# EAGLE design host_0 (EAGLE 9.3.1)
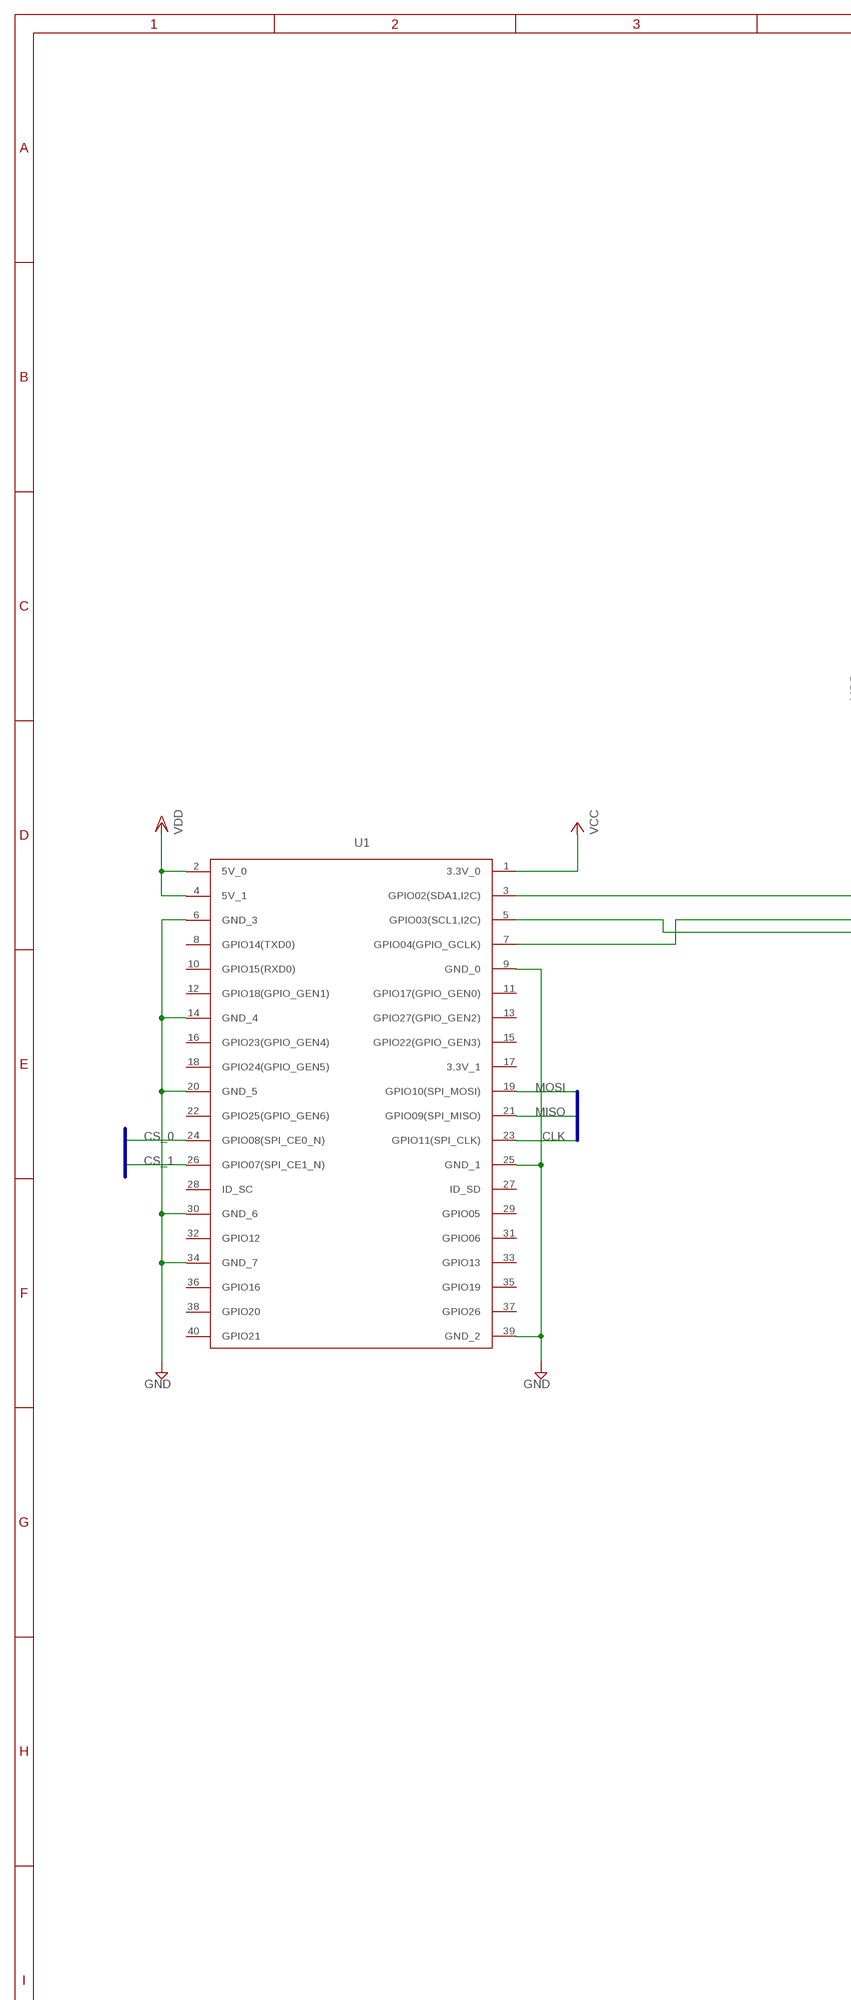
[diagram p0: schematic, sheet 1, part 1 of 2]
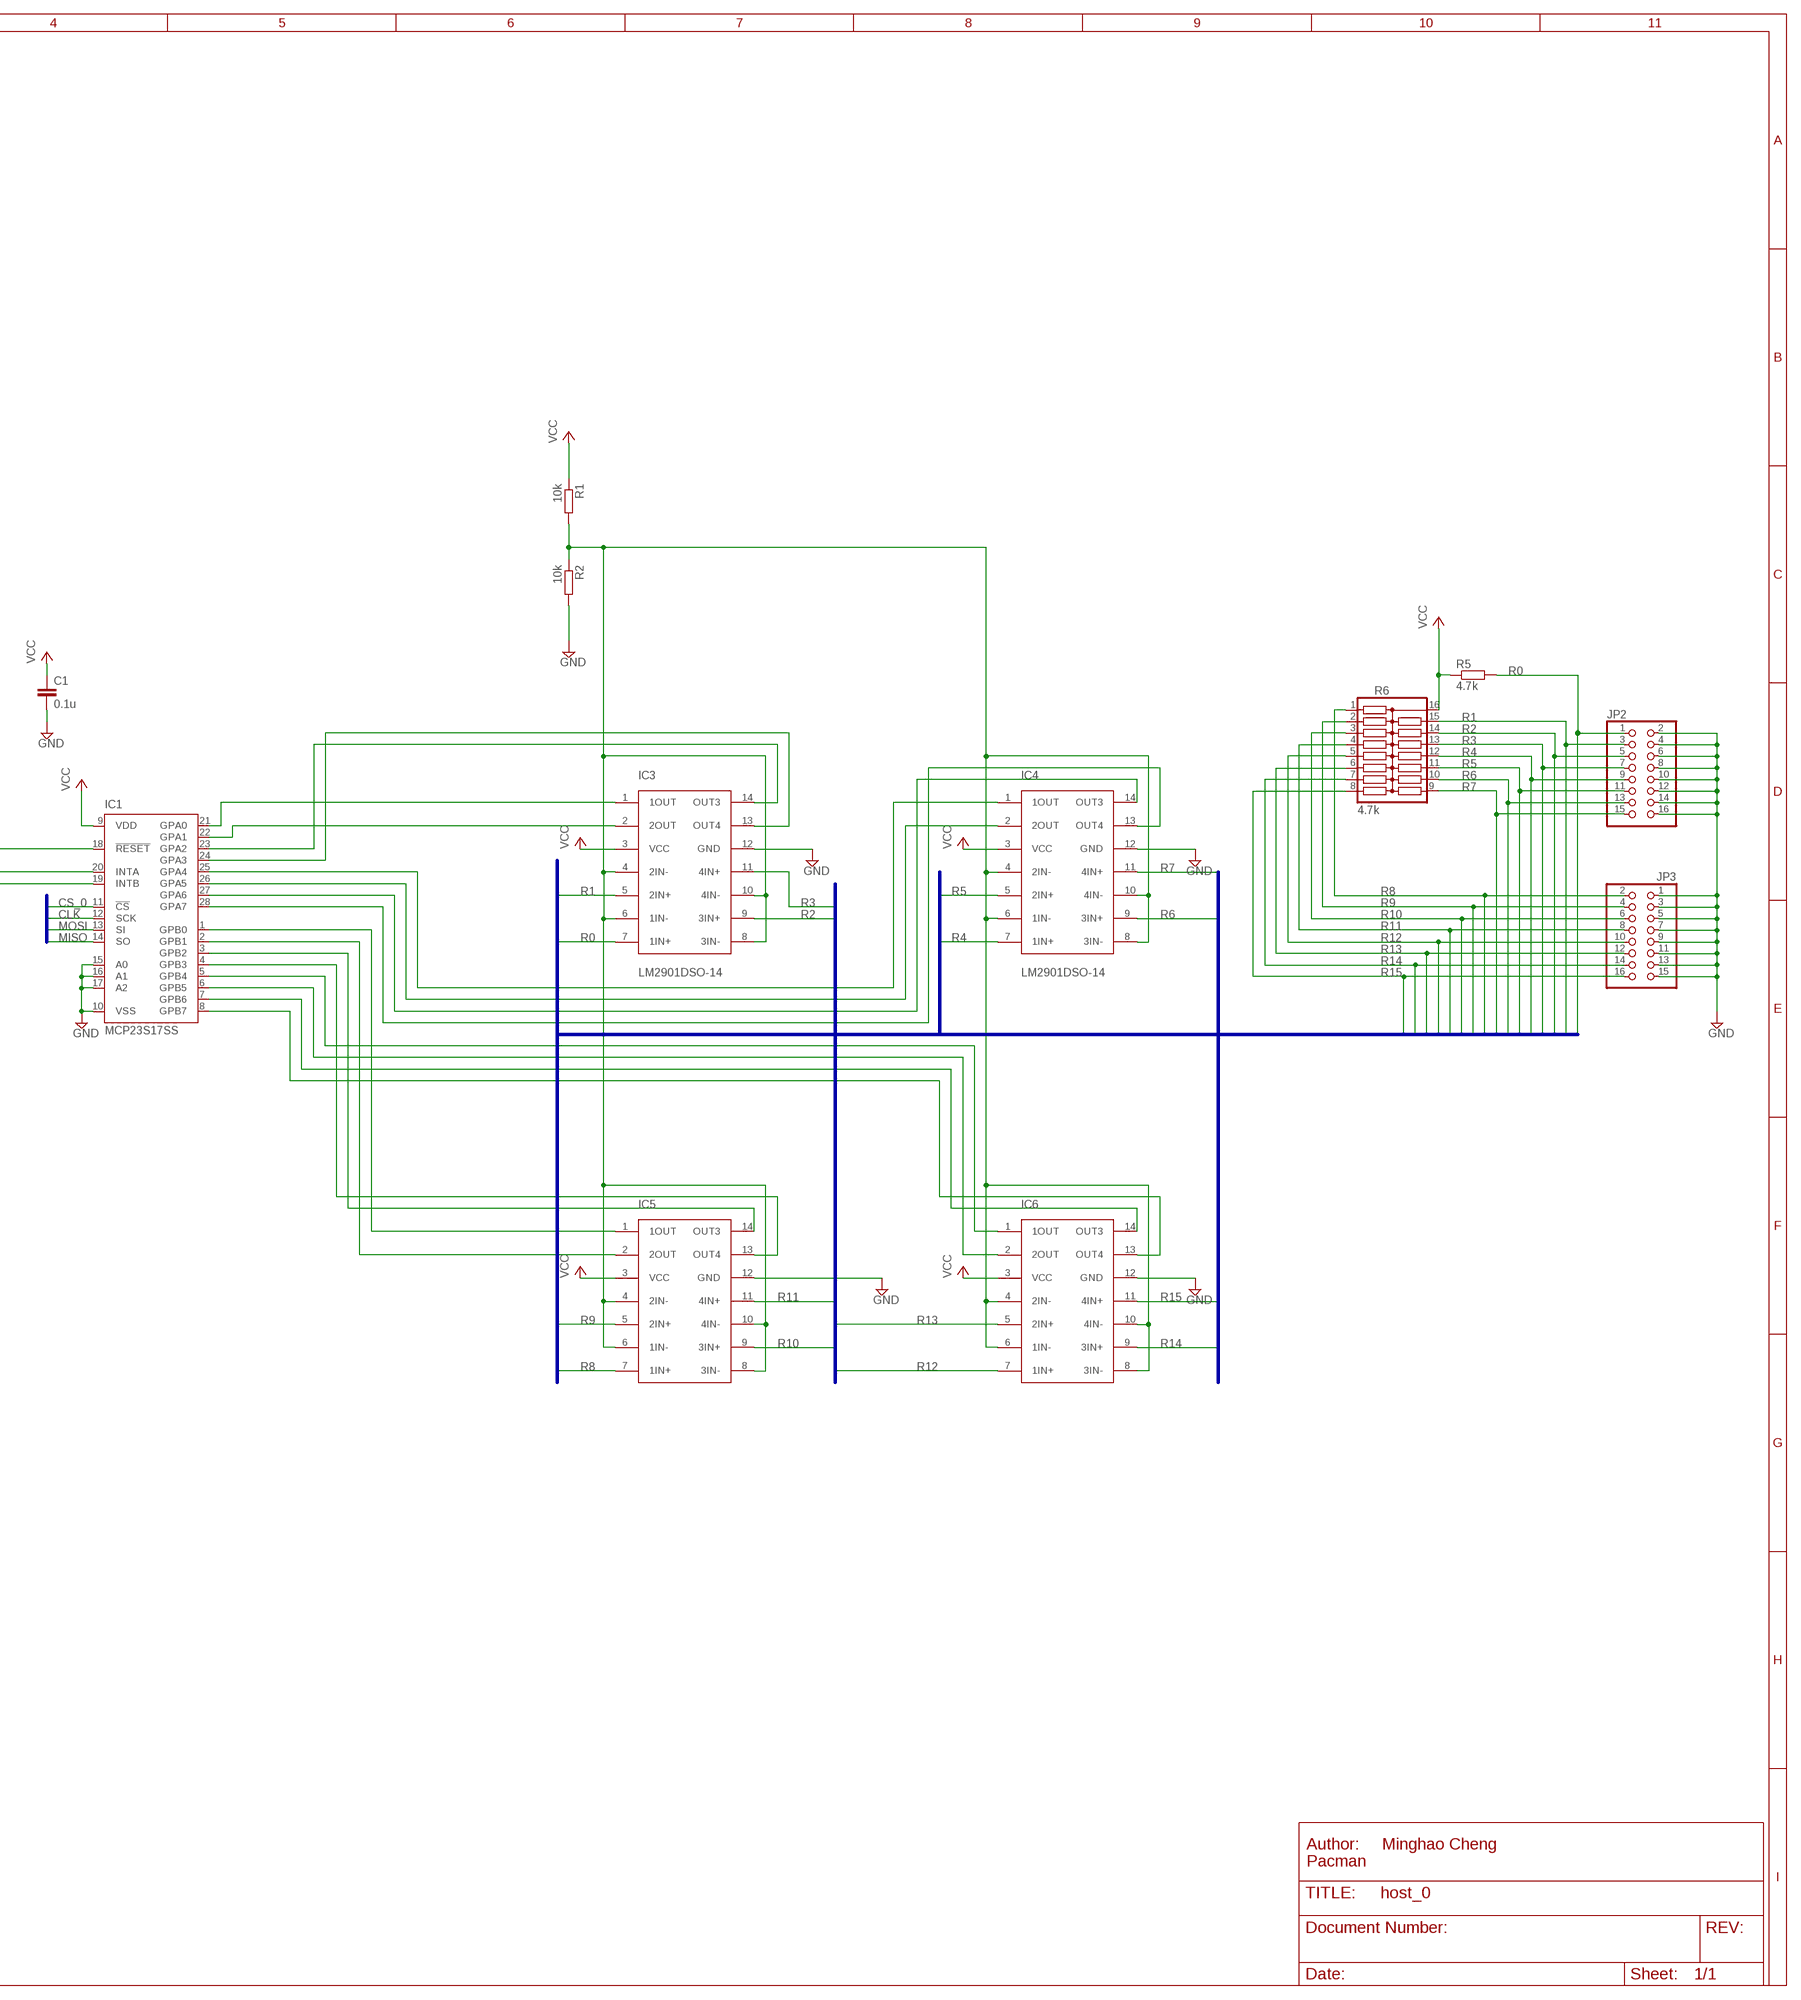
[diagram p1: schematic, sheet 1, part 2 of 2]

## Parts
C1  0.1u  C-EUC0805  [C0805]
IC1  MCP23S17SS  [SSOP28]
IC3  LM2901DSO-14  [SO14]
IC4  LM2901DSO-14  [SO14]
IC5  LM2901DSO-14  [SO14]
IC6  LM2901DSO-14  [SO14]
JP2  PINHD-2X8  [2X08]
JP3  PINHD-2X8  [2X08]
R1  10k  R-EU_R0805  [R0805]
R2  10k  R-EU_R0805  [R0805]
R5  4.7k  R-EU_R0805  [R0805]
R6  4.7k  4816P-T02  [4816P]
U1  RASPI3_GPIO  [FE20-2]

## Nets
CLK: IC1.12(SCK) U1.23(GPIO11(SPI_CLK))
CS_0: IC1.11(!CS) U1.24(GPIO08(SPI_CE0_N))
CS_1: U1.26(GPIO07(SPI_CE1_N))
GND: C1.2 IC1.10(VSS) IC1.15(A0) IC1.16(A1) IC1.17(A2) IC3.12(GND) IC4.12(GND) IC5.12(GND) IC6.12(GND) JP2.2 JP2.4 JP2.6 JP2.8 JP2.10 JP2.12 JP2.14 JP2.16 JP3.1 JP3.3 JP3.5 JP3.7 JP3.9 JP3.11 JP3.13 JP3.15 R2.2 U1.6(GND_3) U1.9(GND_0) U1.14(GND_4) U1.20(GND_5) U1.25(GND_1) U1.30(GND_6) U1.34(GND_7) U1.39(GND_2)
MISO: IC1.14(SO) U1.21(GPIO09(SPI_MISO))
MOSI: IC1.13(SI) U1.19(GPIO10(SPI_MOSI))
N$1: IC1.18(!RESET) U1.3(GPIO02(SDA1,I2C))
N$2: IC1.20(INTA) U1.7(GPIO04(GPIO_GCLK))
N$3: IC1.19(INTB) U1.5(GPIO03(SCL1,I2C))
N$6: IC1.23(GPA2) IC3.14(OUT3)
N$7: IC1.24(GPA3) IC3.13(OUT4)
N$8: IC3.4(2IN-) IC3.6(1IN-) IC3.8(3IN-) IC3.10(4IN-) IC4.4(2IN-) IC4.6(1IN-) IC4.8(3IN-) IC4.10(4IN-) IC5.4(2IN-) IC5.6(1IN-) IC5.8(3IN-) IC5.10(4IN-) IC6.4(2IN-) IC6.6(1IN-) IC6.8(3IN-) IC6.10(4IN-) R1.2 R2.1
N$9: IC1.21(GPA0) IC3.1(1OUT)
N$10: IC1.22(GPA1) IC3.2(2OUT)
N$11: IC1.25(GPA4) IC4.1(1OUT)
N$12: IC1.26(GPA5) IC4.2(2OUT)
N$13: IC1.27(GPA6) IC4.14(OUT3)
N$14: IC1.28(GPA7) IC4.13(OUT4)
N$15: IC1.1(GPB0) IC5.1(1OUT)
N$51: IC1.2(GPB1) IC5.2(2OUT)
N$52: IC1.3(GPB2) IC5.14(OUT3)
N$53: IC1.5(GPB4) IC6.1(1OUT)
N$54: IC1.4(GPB3) IC5.13(OUT4)
N$60: IC1.6(GPB5) IC6.2(2OUT)
N$61: IC1.7(GPB6) IC6.14(OUT3)
N$62: IC1.8(GPB7) IC6.13(OUT4)
R0: IC3.7(1IN+) JP2.1 R5.2
R1: IC3.5(2IN+) JP2.3 R6.15
R2: IC3.9(3IN+) JP2.5 R6.14
R3: IC3.11(4IN+) JP2.7 R6.13
R4: IC4.7(1IN+) JP2.9 R6.12
R5: IC4.5(2IN+) JP2.11 R6.11
R6: IC4.9(3IN+) JP2.13 R6.10
R7: IC4.11(4IN+) JP2.15 R6.9
R8: IC5.7(1IN+) JP3.2 R6.1
R9: IC5.5(2IN+) JP3.4 R6.2
R10: IC5.9(3IN+) JP3.6 R6.3
R11: IC5.11(4IN+) JP3.8 R6.4
R12: IC6.7(1IN+) JP3.10 R6.5
R13: IC6.5(2IN+) JP3.12 R6.6
R14: IC6.9(3IN+) JP3.14 R6.7
R15: IC6.11(4IN+) JP3.16 R6.8
VCC: C1.1 IC1.9(VDD) IC3.3(VCC) IC4.3(VCC) IC5.3(VCC) IC6.3(VCC) R1.1 R5.1 R6.16 U1.1(3.3V_0)
VDD: U1.2(5V_0) U1.4(5V_1)
Unconnected: U1.8(GPIO14(TXD0)) U1.10(GPIO15(RXD0)) U1.11(GPIO17(GPIO_GEN0)) U1.12(GPIO18(GPIO_GEN1)) U1.13(GPIO27(GPIO_GEN2)) U1.15(GPIO22(GPIO_GEN3)) U1.16(GPIO23(GPIO_GEN4)) U1.17(3.3V_1) U1.18(GPIO24(GPIO_GEN5)) U1.22(GPIO25(GPIO_GEN6)) U1.27(ID_SD) U1.28(ID_SC) U1.29(GPIO05) U1.31(GPIO06) U1.32(GPIO12) U1.33(GPIO13) U1.35(GPIO19) U1.36(GPIO16) U1.37(GPIO26) U1.38(GPIO20) U1.40(GPIO21)

## Buses
SPI_PI:CLK,CS_0,CS_1,MISO,MOSI
LDR:R[0..15]

## Notes on the sheet
- Author:     Minghao Cheng
  Pacman

## Library data of the parts
C1 = rcl:C-EU: CAPACITOR, European symbol; SPICEPREFIX: C
IC1 = microchip:MCP23S17: http://ww1.microchip.com/downloads/en/DeviceDoc/21952a.pdf Source: http://ww1.microchip.com/downloads/en/DeviceDoc/21952a.pdf; MF: MICROCHIP; MPN: MCP23S17-E/SS; OC_FARNELL: 1467675; OC_NEWARK: 31K2952
IC3-IC6 = LM2901D:LM2901D
JP2 JP3 = pinhead:PINHD-2X8: PIN HEADER
R1 R2 R5 = rcl:R-EU_: RESISTOR, European symbol; SPICEPREFIX: R
R6 = resistor-bourns:4816P-T02: BOURNS RESISTOR NETWORK; MF: BOURNS, INC.; MPN: 4816P-T02-824LF; OC_FARNELL: 9357599; OC_NEWARK: 33K0777
U1 = PacMan:RASPI3_GPIO

## Net classes
0 default: width 0.305 mm, drill 0.508 mm, clearance 0.254 mm

## Board
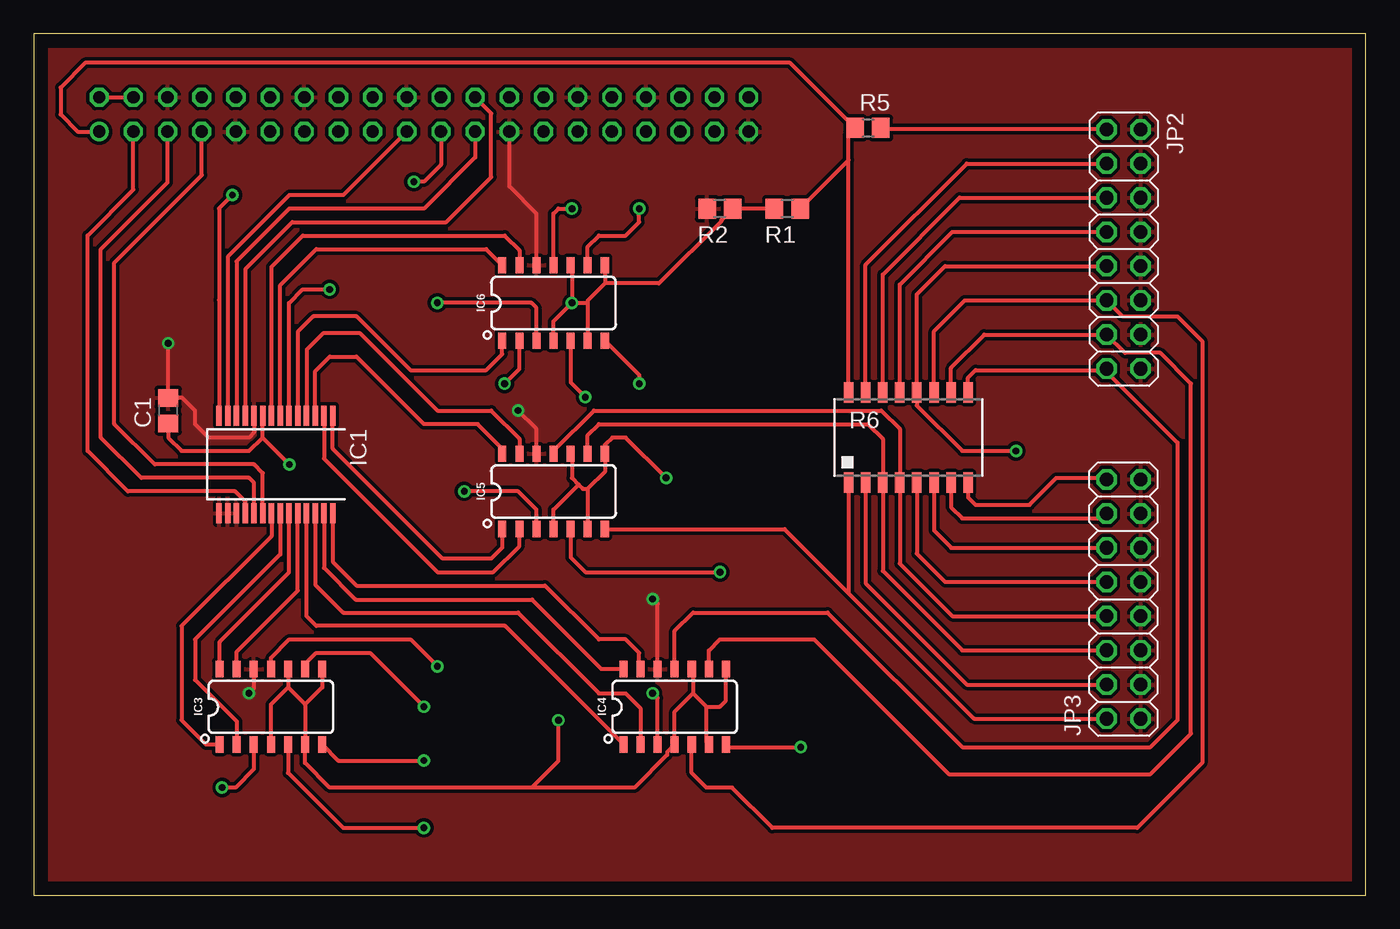
[diagram p2: board, top side]
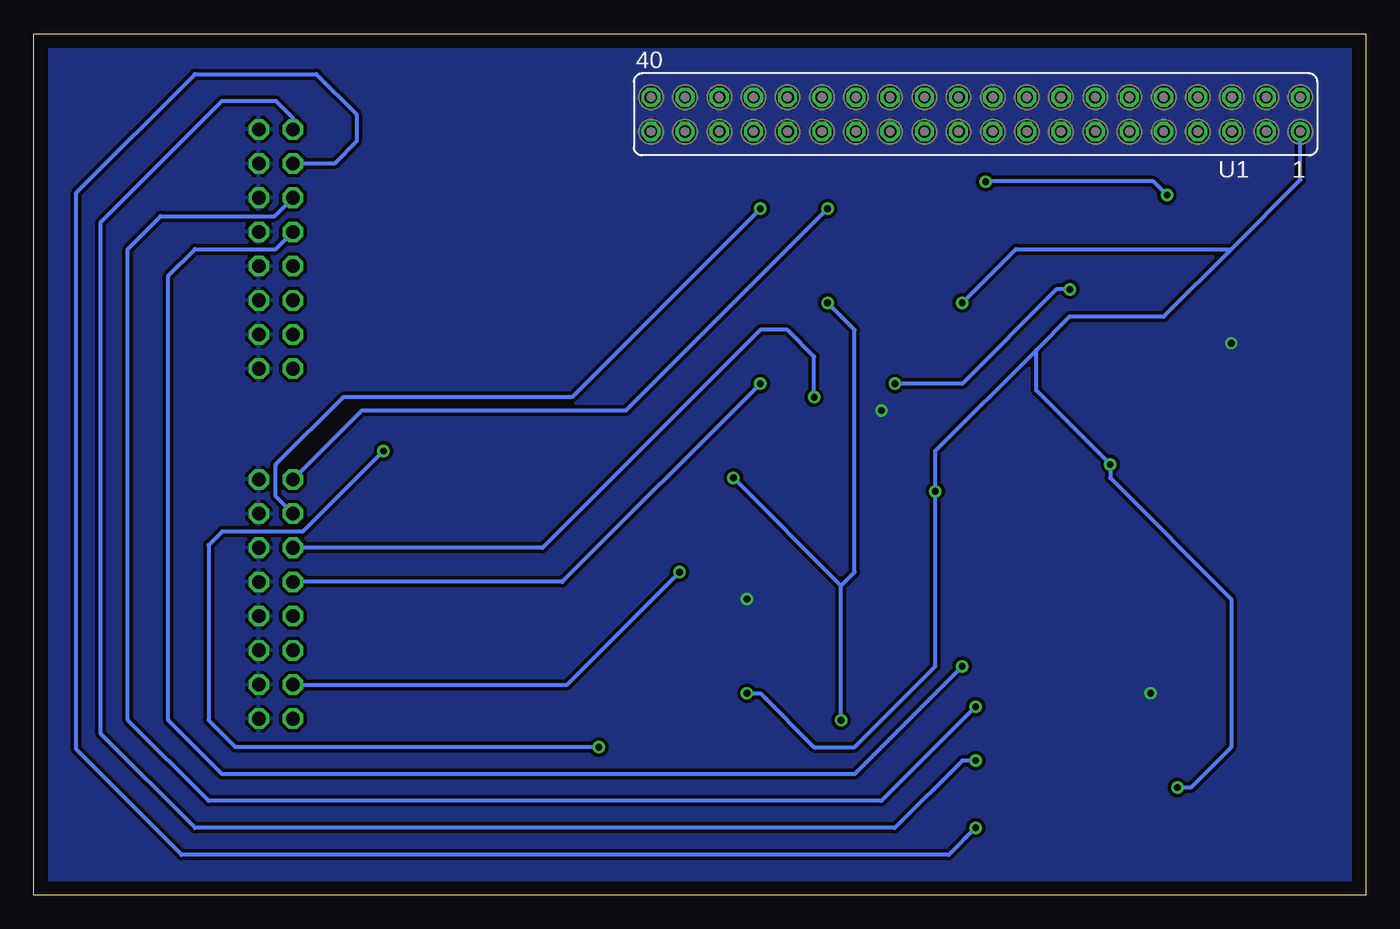
[diagram p3: board, bottom side, seen from below]

Size 99 x 64 mm. Coordinates in mm from the lower left corner, seen from the top.
Outline: 0,0 99,0 99,64 0,64 0,0
Copper layers (1*16): Top 0.035mm / dielectric 1.5mm / Bottom 0.035mm
Design rules "default": minimum track width 6mil, minimum drill 0.35mm, track to track 6mil, track to pad 6mil, pad to pad 6mil, via to via 6mil, smd to smd 6mil, copper to edge 40mil, drill to drill 6mil, minimum pad ring 10mil, minimum via ring 8mil, stop-mask expansion 4mil, vias tented up to drill 0mil, thermal gap 10mil

### Footprints (pad centres in the part's own frame; a part is rotated, then mirrored left to right if it is on the bottom)
C0805 = smd 1.3 x 1.5: 1 -0.95,0; 2 0.95,0
SSOP28 = smd 0.4 x 1.5: 1 -4.225,-3.625; 2 -3.575,-3.625; 3 -2.925,-3.625; 4 -2.275,-3.625; 5 -1.625,-3.625; 6 -0.975,-3.625; 7 -0.325,-3.625; 8 0.325,-3.625; 9 0.975,-3.625; 10 1.625,-3.625; 11 2.275,-3.625; 12 2.925,-3.625; 13 3.575,-3.625; 14 4.225,-3.625; 15 4.225,3.625; 16 3.575,3.625; 17 2.925,3.625; 18 2.275,3.625; 19 1.625,3.625; 20 0.975,3.625; 21 0.325,3.625; 22 -0.325,3.625; 23 -0.975,3.625; 24 -1.625,3.625; 25 -2.275,3.625; 26 -2.925,3.625; 27 -3.575,3.625; 28 -4.225,3.625
SO14 = smd 0.6 x 1.2: 1 -3.175,-2.8; 2 -1.905,-2.8; 3 -0.635,-2.8; 4 0.635,-2.8; 5 1.905,-2.8; 6 3.175,-2.8; 7 4.445,-2.8; 8 4.445,2.8; 9 3.175,2.8; 10 1.905,2.8; 11 0.635,2.8; 12 -0.635,2.8; 13 -1.905,2.8; 14 -3.175,2.8
2X08 = drill 1.016 octagon: 1 -8.89,-1.27; 2 -8.89,1.27; 3 -6.35,-1.27; 4 -6.35,1.27; 5 -3.81,-1.27; 6 -3.81,1.27; 7 -1.27,-1.27; 8 -1.27,1.27; 9 1.27,-1.27; 10 1.27,1.27; 11 3.81,-1.27; 12 3.81,1.27; 13 6.35,-1.27; 14 6.35,1.27; 15 8.89,-1.27; 16 8.89,1.27
R0805 = smd 1.3 x 1.5: 1 -0.95,0; 2 0.95,0
4816P = smd 0.7 x 1.5: 1 -4.445,-3.346; 2 -3.175,-3.346; 3 -1.905,-3.346; 4 -0.635,-3.346; 5 0.635,-3.346; 6 1.905,-3.346; 7 3.175,-3.346; 8 4.445,-3.346; 9 4.445,3.346; 10 3.175,3.346; 11 1.905,3.346; 12 0.635,3.346; 13 -0.635,3.346; 14 -1.905,3.346; 15 -3.175,3.346; 16 -4.445,3.346
FE20-2 = drill 0.914: 1 -24.13,1.27 | drill 0.914 octagon: 2 -24.13,-1.27; 3 -21.59,1.27; 4 -21.59,-1.27; 5 -19.05,1.27; 6 -19.05,-1.27; 7 -16.51,1.27; 8 -16.51,-1.27; 9 -13.97,1.27; 10 -13.97,-1.27; 11 -11.43,1.27; 12 -11.43,-1.27; 13 -8.89,1.27; 14 -8.89,-1.27; 15 -6.35,1.27; 16 -6.35,-1.27; 17 -3.81,1.27; 18 -3.81,-1.27; 19 -1.27,1.27; 20 -1.27,-1.27; 21 1.27,1.27; 22 1.27,-1.27; 23 3.81,1.27; 24 3.81,-1.27; 25 6.35,1.27; 26 6.35,-1.27; 27 8.89,1.27; 28 8.89,-1.27; 29 11.43,1.27; 30 11.43,-1.27; 31 13.97,1.27; 32 13.97,-1.27; 33 16.51,1.27; 34 16.51,-1.27; 35 19.05,1.27; 36 19.05,-1.27; 37 21.59,1.27; 38 21.59,-1.27; 39 24.13,1.27; 40 24.13,-1.27

### Placement (x,y rotation side)
C1  10,36 90 top
IC1  18,32 180 top
IC3  17,14 0 top
IC4  47,14 0 top
IC5  38,30 0 top
IC6  38,44 0 top
JP2  81,48 270 top
JP3  81,22 90 top
R1  56,51 180 top
R2  51,51 180 top
R5  62,57 0 top
R6  65,34 0 top
U1  29,58 180 bottom

### Tracks (layer width: path | path; a pad name or v marks a point on that pad's centre or on a via)
CLK
  Top 0.305: U1.23 32.81,54.81 29,51 19,51 15.07,47.08 IC1.12
CS_0
  Top 0.305: IC1.11 15.77,35.67 15.77,46.54 19.23,50 30.66,50 34,53.34 34,58.08 U1.24
GND  (via drill 0.51)
  Top 0.305: IC6.12 37.37,50.63 35.35,52.65 U1.25 | IC1.10 16.38,34.38 16,34 13,34 12,35 12,36 11.05,36.95 C1.2 v10,41 | IC5.12 37.37,34.63 v36,36 | IC3.12 16.36,15.37 v16,15 | IC4.12 46.37,21.64 v46,22
  pour Bottom: 1,63 1,1 98,1 98,63
  pour Top: 1,63 98,63 98,2 98,1 1,1
MISO  (via drill 0.51)
  Top 0.305: IC1.14 13.78,44.23 13.78,51.02 v14.78,52.02 | U1.21 30.27,54.27 29,53 v28.25,53
  Bottom 0.305: v28.25,53 28.23,53.02 15.78,53.02 v14.78,52.02
MOSI
  Top 0.305: U1.19 23,52 19,52 14.43,47.42 IC1.13
N$1
  Top 0.305: U1.3 7.41,52.41 4,49 4,33 7,30 14.97,30 15.72,29.25 IC1.18
N$2
  Top 0.305: U1.7 12.49,53.49 6,47 6,35 9,32 16.37,32 17.02,31.34 IC1.20
N$3
  Top 0.305: IC1.19 16.38,30.62 16,31 8,31 5,34 5,48 9.95,52.95 U1.5
N$6
  Top 0.305: IC3.14 13.82,18.82 18.98,23.98 IC1.23
N$7
  Top 0.305: IC3.13 15.1,18.09 19.62,22.62 IC1.24
N$8  (via drill 0.51)
  Top 0.305: IC4.10 49,16.7 49,15 | 49,15 50,14 | 50,14 51,14 51.45,14.45 IC4.8 | IC4.6 50,11.38 50,14 | 49,15 47.63,13.63 IC4.4 47.07,10.64 47.07,10.43 44.64,8 37,8 | IC6.8 42.45,45.45 | 41.17,44 IC6.6 | IC6.10 40,46.7 v40,44 | IC6.4 38.63,42.63 v40,44 | IC3.8 21.45,15.45 20.18,14.18 | 20.18,14.18 IC3.6 20.18,9.82 22,8 37,8 | IC3.10 18.91,15.45 | 18.91,15.45 20.18,14.18 | IC3.4 17.64,14.18 18.91,15.45 | 41.17,30.18 IC5.6 | 41.17,30.18 42.45,31.45 IC5.8 42.45,33.45 43,34 44,34 v47,31 | IC5.10 40,32.7 40,31 40.5,30.5 | 40.5,30.5 40.83,30.18 41.17,30.18 | IC5.4 38.63,28.64 40.5,30.5 | v39,13 39,10 37,8 | R1.2 R2.1 51.11,50.16 51.11,50.08 46.47,45.45 42.45,45.45 | v40,44 41.17,44 | 42.45,45.45 41.17,44.17 41.17,44
  Bottom 0.305: v39,13 39,23 | 39,23 v47,31 | 39,23 38,24 38,42 v40,44
N$9
  Top 0.305: IC1.21 17.68,26.68 11,20 11,13 12.8,11.2 IC3.1
N$10
  Top 0.305: IC1.22 18.32,25.32 12,19 12,16 15.1,12.9 IC3.2
N$11
  Top 0.305: IC4.1 35.02,20 21,20 20.27,20.73 IC1.25
N$12
  Top 0.305: IC4.2 45.09,13.9 44,15 42,15 36,21 23,21 20.93,23.07 IC1.26
N$13
  Top 0.305: IC4.14 42.2,16.8 37.04,21.96 23.93,21.96 21.57,24.32 IC1.27
N$14
  Top 0.305: IC1.28 22.23,24.77 24,23 38,23 42,19 44,19 45,18 45,16.89 IC4.13
N$15
  Top 0.305: IC5.1 34.83,25.82 34,25 30.4,25 22.23,33.17 IC1.1
N$51
  Top 0.305: IC1.2 21.57,32.42 30,24 34.16,24 36.09,25.93 IC5.2
N$52
  Top 0.305: IC1.3 20.93,38.92 22,40 24,40 29,35 33,35 34.83,33.17 IC5.14
N$53
  Top 0.305: IC1.5 19.62,41.84 20.78,43 24,43 28,39 33.62,39 34.83,40.2 IC6.1
N$54
  Top 0.305: IC1.4 20.32,35.67 20.32,40.54 21.56,41.78 24.22,41.78 30,36 34,36 36.09,33.91 IC5.13
N$60  (via drill 0.51)
  Top 0.305: IC1.6 18.98,43.98 20,45 v22,45 | v35,38 36.09,39.09 IC6.2
  Bottom 0.305: v22,45 23,45 30,38 v35,38
N$61
  Top 0.305: IC1.7 18.32,45.33 21,48 33.62,48 IC6.14
N$62
  Top 0.305: IC1.8 17.68,46.67 20,49 35,49 36.09,47.91 IC6.13
R0  (via drill 0.51)
  Top 0.305: JP2.1 63.06,56.89 R5.2 | IC3.7 22.64,10 v29,10
  Bottom 0.305: v29,10 30,10 35,5 87,5 94,12 94,50 85,59 81,59 79.73,57.73 JP2.1
R1  (via drill 0.51)
  Top 0.305: R6.15 61.83,46.83 69.35,54.35 JP2.3 | IC3.5 18.91,9.1 23,5 v29,5
  Bottom 0.305: v29,5 31,3 88,3 95.83,10.83 95.83,52.17 87,61 78,61 75,58 75,56 76.65,54.35 JP2.3
R2  (via drill 0.51)
  Top 0.305: R6.14 63.09,46.09 68.81,51.81 JP2.5 | IC3.9 20.18,17.18 21,18 25,18 v29,14
  Bottom 0.305: v29,14 36,7 86,7 92,13 92,48 89.56,50.44 81.1,50.44 JP2.5
R3  (via drill 0.51)
  Top 0.305: R6.13 64.36,45.37 68.27,49.27 JP2.7 | IC3.11 17.64,17.64 19,19 28,19 v30,17
  Bottom 0.305: v30,17 38,9 85,9 89,13 89,46 87,48 81,48 JP2.7
R4  (via drill 0.51)
  Top 0.305: JP2.9 67.73,46.73 65.64,44.63 R6.12 65.64,36.37 69,33 v73,33 | IC4.7 51.65,11 v57,11
  Bottom 0.305: v73,33 79,27 85,27 86,26 86,13 84,11 v57,11
R5
  Top 0.305: R6.11 66.91,41.91 69.19,44.19 JP2.11 80.92,43 85,43 86.83,41.17 86.83,9.83 82,5 54.9,5 51.9,8 50,8 48.91,9.1 IC4.5
R6
  Top 0.305: R6.10 68.17,39.17 70.65,41.65 JP2.13 81.1,40.28 83.72,40.28 86,38 86,12 83,9 68,9 58,19 51,19 50.17,18.18 IC4.9
R7
  Top 0.305: R6.9 69.44,38.45 70,39 79.62,39 | 79.62,39 JP2.15 | IC4.11 47.63,19.64 49,21 59,21 69,11 83,11 85,13 85,33.62 79.62,39
R8
  Top 0.305: R6.1 60.55,22.45 | JP3.2 69.89,13.11 60.55,22.45 | IC5.7 55.8,27.2 60.55,22.45
R9  (via drill 0.51)
  Top 0.305: R6.2 61.83,23.18 69.35,15.65 JP3.4 | IC5.5 39.91,25.09 41,24 v51,24
  Bottom 0.305: JP3.4 59.35,15.65 v51,24
R10
  Top 0.305: IC5.9 41.17,34.17 42,35 62,35 63.09,33.91 R6.3 63.09,24.09 69,18.19 JP3.6
R11
  Top 0.305: JP3.8 68.27,20.73 64.36,24.64 R6.4 64.36,34.63 63,36 41.63,36 38.63,33.01 IC5.11
R12  (via drill 0.51)
  Top 0.305: R6.5 65.64,25.36 67.73,23.27 JP3.10 | IC6.7 45,38.65 v45,38
  Bottom 0.305: v45,38 59.73,23.27 JP3.10
R13  (via drill 0.51)
  Top 0.305: R6.6 66.91,27.09 68.19,25.81 JP3.12 | IC6.5 39.91,38.09 v41,37
  Bottom 0.305: v41,37 41,40 43,42 45,42 61.19,25.81 JP3.12
R14  (via drill 0.51)
  Top 0.305: R6.7 68.17,28.82 69,28 79.38,28 JP3.14 | IC6.9 41.17,48.17 42,49 44,49 45,50 v45,51
  Bottom 0.305: JP3.14 81,29.62 81,32 76,37 59,37 v45,51
R15  (via drill 0.51)
  Top 0.305: R6.8 69.44,29.55 70,29 74,29 76,31 79.62,31 JP3.16 | IC6.11 38.63,50.63 39,51 v40,51
  Bottom 0.305: v40,51 55,36 74.62,36 JP3.16
VCC  (via drill 0.51)
  Top 0.305: 17,34 16,33 11,33 10,34 C1.1 | 17,34 17,35.6 IC1.9 | IC6.3 37.37,43.63 37,44 v30,44 | R6.16 60.55,54.6 | 60.55,54.6 60.55,56.55 61.02,57.02 | IC4.3 46.37,14.63 v46,15 | IC5.3 37.37,28.64 36,30 v32,30 | v19,32 17,34 | R5.1 61.02,57.02 | 61.02,57.02 56.22,61.83 3.83,61.83 2,60 2,58 3.27,56.73 U1.1 | R1.1 60.55,54.6 | IC3.3 16.36,9.37 15,8 v14,8
  Bottom 0.305: v30,44 26,48 10,48 | 10,48 4.87,53.13 U1.1 | v46,15 45,15 41,11 38,11 32,17 v32,30 32,33 24.5,40.5 | 10,48 15,43 22,43 24.5,40.5 | v14,8 13,8 10,11 10,22 19,31 v19,32 24.5,37.5 24.5,40.5
VDD
  Top 0.305: U1.2 U1.4